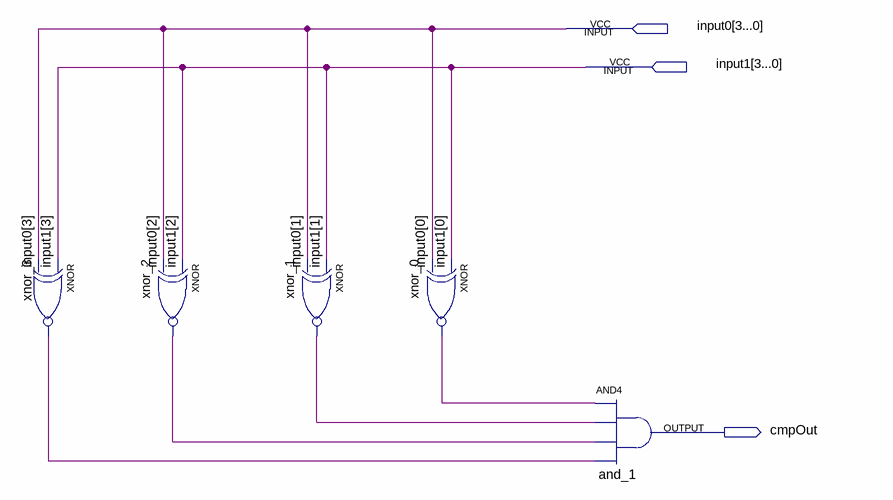
[diagram p0: schematic sheet]
// Quartus schematic EqCmp4.bdf as structural Verilog: 5 symbols, 3 pins
module EqCmp4 (
  input  \input0[3...0] ,
  input  \input1[3...0] ,
  output cmpOut
);

  wire xnor_0_out, xnor_1_out, xnor_2_out, xnor_3_out;

  xnor xnor_3 (xnor_3_out, \input1[3...0] , \input0[3...0] );
  xnor xnor_2 (xnor_2_out, \input1[3...0] , \input0[3...0] );
  xnor xnor_1 (xnor_1_out, \input1[3...0] , \input0[3...0] );
  xnor xnor_0 (xnor_0_out, \input1[3...0] , \input0[3...0] );
  // AND4 and_1 has open pins: IN1=xnor_0_out, IN2=xnor_1_out, IN3=xnor_2_out, IN4=xnor_3_out, OUT=open

  // Other names for the same wires on the sheet: input0[3:0] = {4{\input0[3...0] }};
  //   input1[3:0] = {4{\input1[3...0] }}
endmodule
